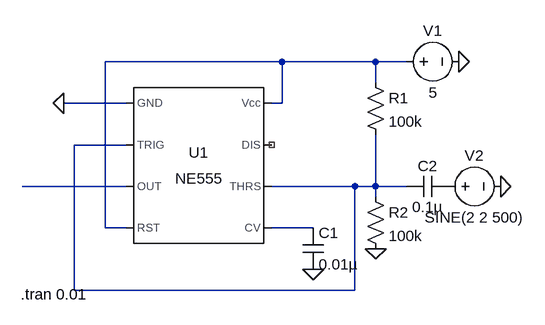
[diagram p0: schematic 555 Schmidt Trigger.asc]
555 Schmidt Trigger.asc, the LTspice schematic file:
Version 4
SHEET 1 880 680
WIRE 144 0 -128 0
WIRE 288 0 144 0
WIRE 336 0 288 0
WIRE 288 32 288 0
WIRE -96 64 -192 64
WIRE 144 64 144 0
WIRE 144 64 128 64
WIRE -96 128 -176 128
WIRE -96 192 -256 192
WIRE 256 192 128 192
WIRE 288 192 288 112
WIRE 288 192 256 192
WIRE 336 192 288 192
WIRE 288 208 288 192
WIRE -128 256 -128 0
WIRE -96 256 -128 256
WIRE 192 256 128 256
WIRE -176 352 -176 128
WIRE 256 352 256 192
WIRE 256 352 -176 352
FLAG 192 320 0
FLAG -192 64 0
FLAG 288 288 0
FLAG 416 0 0
FLAG 480 192 0
SYMBOL Misc\\NE555 16 160 R0
SYMATTR InstName U1
SYMBOL cap 176 256 R0
SYMATTR InstName C1
SYMATTR Value 0.01µ
SYMBOL res 272 16 R0
SYMATTR InstName R1
SYMATTR Value 100k
SYMBOL res 272 192 R0
SYMATTR InstName R2
SYMATTR Value 100k
SYMBOL cap 400 176 R90
WINDOW 0 0 32 VBottom 2
WINDOW 3 32 32 VTop 2
SYMATTR InstName C2
SYMATTR Value 0.1µ
SYMBOL voltage 320 0 R270
WINDOW 0 32 56 VTop 2
WINDOW 3 -32 56 VBottom 2
WINDOW 123 0 0 Left 0
WINDOW 39 0 0 Left 0
SYMATTR InstName V1
SYMATTR Value 5
SYMBOL voltage 384 192 R270
WINDOW 0 32 56 VTop 2
WINDOW 3 -32 56 VBottom 2
WINDOW 123 0 0 Left 0
WINDOW 39 0 0 Left 0
SYMATTR InstName V2
SYMATTR Value SINE(2 2 500)
TEXT -258 358 Left 2 !.tran 0.01

The netlist it stands for:
* 555 Schmidt Trigger.asc
XU1 0 N002 N003 N001 N004 N002 NC_01 N001 NE555  ; pins GND TRIG OUT RST CV THRS DIS Vcc
C1 N004 0 0.01µ
R1 N001 N002 100k
R2 N002 0 100k
C2 P001 N002 0.1µ
V1 N001 0 5
V2 P001 0 SINE(2 2 500)
.tran 0.01
.lib NE555.sub
.backanno
.end